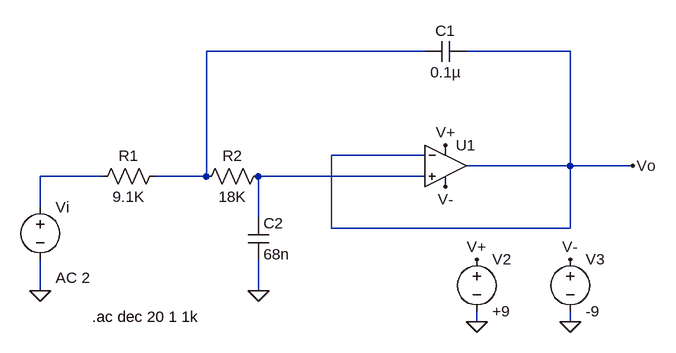
[diagram p0: schematic LPF.asc]
LPF.asc, the LTspice schematic file:
Version 4
SHEET 1 880 680
WIRE 224 -64 -112 -64
WIRE 448 -64 288 -64
WIRE 224 96 80 96
WIRE 448 112 448 -64
WIRE 448 112 288 112
WIRE 544 112 448 112
WIRE -272 128 -368 128
WIRE -112 128 -112 -64
WIRE -112 128 -192 128
WIRE 224 128 -32 128
WIRE -368 176 -368 128
WIRE -32 192 -32 128
WIRE 80 208 80 96
WIRE 448 208 448 112
WIRE 448 208 80 208
WIRE -368 304 -368 256
WIRE -32 304 -32 256
WIRE 304 352 304 336
WIRE 448 352 448 336
FLAG -368 304 0
FLAG -32 304 0
FLAG 304 256 V+
FLAG 448 256 V-
FLAG 304 352 0
FLAG 448 352 0
FLAG 256 80 V+
FLAG 256 144 V-
FLAG 544 112 Vo
SYMBOL cap -48 192 R0
SYMATTR InstName C2
SYMATTR Value 68n
SYMBOL res -16 112 R90
WINDOW 0 0 56 VBottom 2
WINDOW 3 32 56 VTop 2
SYMATTR InstName R2
SYMATTR Value 18K
SYMBOL res -176 112 R90
WINDOW 0 0 56 VBottom 2
WINDOW 3 32 56 VTop 2
SYMATTR InstName R1
SYMATTR Value 9.1K
SYMBOL cap 288 -80 R90
WINDOW 0 0 32 VBottom 2
WINDOW 3 32 32 VTop 2
SYMATTR InstName C1
SYMATTR Value 0.1µ
SYMBOL voltage -368 160 R0
WINDOW 123 24 124 Left 2
WINDOW 39 0 0 Left 0
SYMATTR Value2 AC 2
SYMATTR InstName Vi
SYMATTR Value ""
SYMBOL voltage 304 240 R0
SYMATTR InstName V2
SYMATTR Value +9
SYMBOL voltage 448 240 R0
SYMATTR InstName V3
SYMATTR Value -9
SYMBOL OpAmps\\UniversalOpAmp2 256 112 R0
SYMATTR InstName U1
TEXT -288 344 Left 2 !.ac dec 20 1 1k

The netlist it stands for:
* LPF.asc
C2 N003 0 68n
R2 N003 N001 18K
R1 N001 N002 9.1K
C1 Vo N001 0.1µ
Vi N002 0 AC 2
V2 V+ 0 +9
V3 V- 0 -9
XU1 N003 Vo V+ V- Vo level2 Avol=1Meg GBW=10Meg Slew=10Meg Ilimit=25m Rail=0 Vos=0 En=0 Enk=0 In=0 Ink=0 Rin=500Meg  ; pins In+ In- V+ V- OUT
.ac dec 20 1 1k
.lib UniversalOpAmp2.lib
.backanno
.end